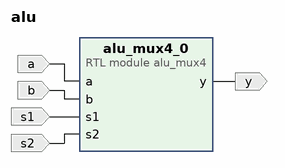
[diagram p0: block diagram of the top level]
# Vivado block design alu, xc7a100tcsg324-1, Vivado 2021.2
create_bd_design alu

create_bd_port -dir I a
create_bd_port -dir I b
create_bd_port -dir I s1
create_bd_port -dir I s2
create_bd_port -dir O y

create_bd_cell -type module -reference alu_mux4 alu_mux4_0

# ---- connections ----

connect_bd_net -net a_0_1 [get_bd_ports a] [get_bd_pins alu_mux4_0/a]
connect_bd_net [get_bd_pins alu_mux4_0/y] [get_bd_ports y]
connect_bd_net -net b_0_1 [get_bd_ports b] [get_bd_pins alu_mux4_0/b]
connect_bd_net -net s1_0_1 [get_bd_ports s1] [get_bd_pins alu_mux4_0/s1]
connect_bd_net -net s2_0_1 [get_bd_ports s2] [get_bd_pins alu_mux4_0/s2]

validate_bd_design
save_bd_design
